# EAGLE design MTSensorV2.1 (EAGLE 8.0.2)
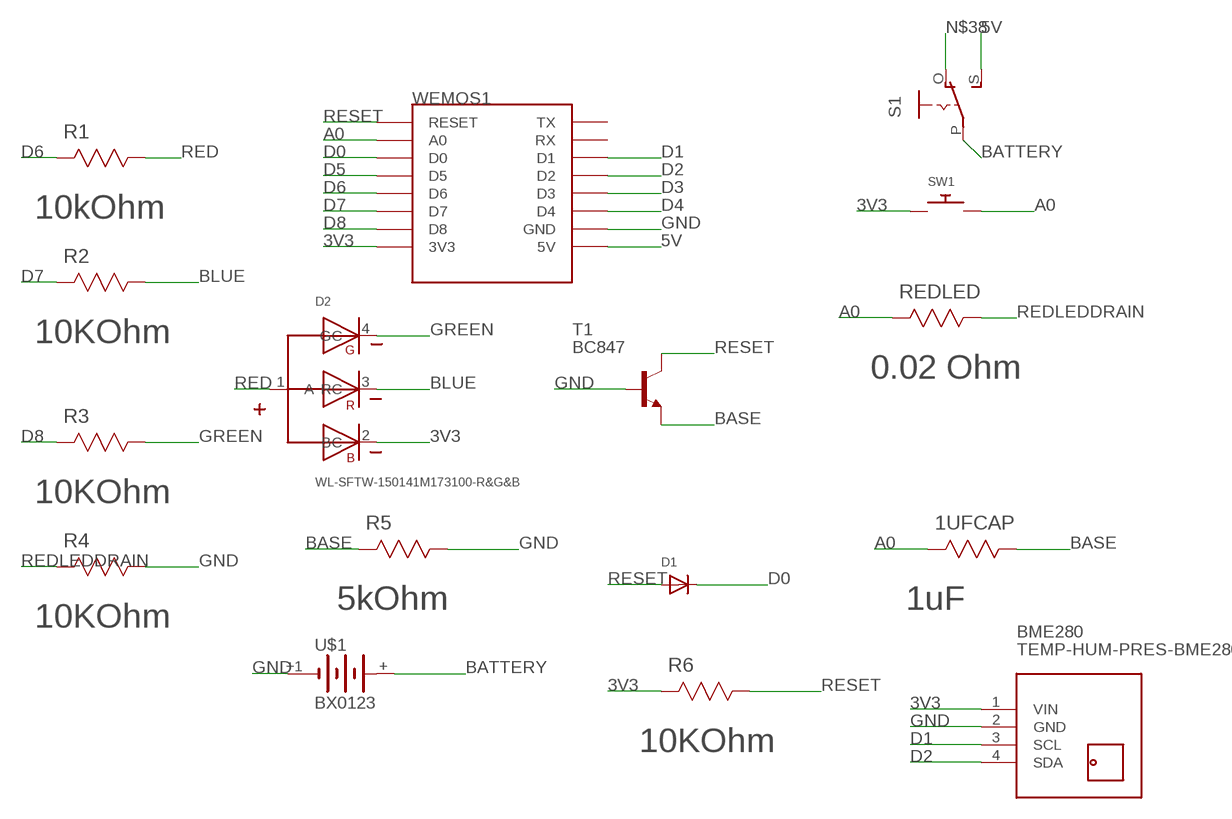
[diagram p0: schematic, sheet 1]

## Parts
1UFCAP  1uF  ERA-3AEB101V  [RESC1608X60N]
BME280  TEMP-HUM-PRES-BME280  [TEMP-HUM-PRES-BME280]
D1  DIODESOD-123  [SOD-123]
D2  WL-SFTW-150141M173100-R&G&B  [3528-COMMON-ANODE]
R1  10kOhm  ERJ-8BWFR010V  [RESC3216X71N]
R2  10KOhm  ERJ-8BWFR010V  [RESC3216X71N]
R3  10KOhm  ERJ-8BWFR010V  [RESC3216X71N]
R4  10KOhm  ERJ-8BWFR010V  [RESC3216X71N]
R5  5kOhm  ERJ-8BWFR011V  [RESC3216X71N]
R6  10KOhm  ERJ-8BWFR010V  [RESC3216X71N]
REDLED  0.02 Ohm  ERJ-8BWFR030V  [RESC3216X71N]
S1  EG1218S  [EG1218]
SW1  SWITCH_PUSHBUTTONEVQ-PE  [TACT_PANA-EVQ]
T1  BC847  [SOT23]
U$1  BX0123  [CR123A_HOLDER]
WEMOS1  WEMOS-D1-MINI  [WEMOS-D1-MINI]

## Nets
3V3: BME280.1(VIN) D2.2(BC) R6.2(R2) SW1.P$1 WEMOS1.3V3
5V: S1.S WEMOS1.5V
A0: 1UFCAP.2(R2) REDLED.2(R2) SW1.P$2 WEMOS1.A0
BASE: 1UFCAP.1(R1) R5.2(R2) T1.2(E)
BATTERY: S1.P U$1.+
BLUE: D2.3(RC) R2.1(R1)
D0: D1.C WEMOS1.D0
D1: BME280.3(SCL) WEMOS1.D1
D2: BME280.4(SDA) WEMOS1.D2
D3: WEMOS1.D3
D4: WEMOS1.D4
D5: WEMOS1.D5
D6: R1.2(R2) WEMOS1.D6
D7: R2.2(R2) WEMOS1.D7
D8: R3.2(R2) WEMOS1.D8
GND: BME280.2(GND) R4.1(R1) R5.1(R1) T1.1(B) U$1.+1(-) WEMOS1.GND
GREEN: D2.4(GC) R3.1(R1)
N$38: S1.O
RED: D2.1(A) R1.1(R1)
REDLEDDRAIN: R4.2(R2) REDLED.1(R1)
RESET: D1.A R6.1(R1) T1.3(C) WEMOS1.RESET
Unconnected: WEMOS1.RX WEMOS1.TX

## Library data of the parts
1UFCAP = Panasonic_By_element14_Batch_1:ERA-3AEB101V: RESISTOR, 0603; MPN: ERA-3AEB101V; OC_FARNELL: 1577593; OC_NEWARK: 08N2093; SUPPLIER: Panasonic; TOLERANCE: ±0.1%; VALUE: 100 Ohm; WATTAGE: 0.1 W
BME280 = diy-modules:TEMP-HUM-PRES-BME280: Digital Humidity-Temperature-Pressure Sensor based on BME280 device More information about BME280 device is available here: https://www.bosch-sensortec.com/bst/products/all_products/bme280 Click here to find device on ebay.com <http://www.ebay.com/sch/bme280+breakout>
D1 = adafruit:DIODE: Diode SMADIODE - SMA Surface Mount Package 20V 1A Schottky Diode Digikey: 641-1014-6-ND DO-1N4148 - Through Hole Small Current Diode SOD-123 20V 1 A (.5mV Vf) Schottky Diode - Digikey: MBRX120TPMSCT-ND SOD-323 10V 570mA (.38mV Vf, 3ns) Schottky Diode - Digikey: ZLLS410CT-ND SOD-523 30V 30mA Schottky Diode (RB751S-40TE61) - Digikey: RB751S-40TE61CT-ND SOT23-R/W - SOT23 Package (R = Solder Paste/Reflow Ovens, W = Hand-Soldering) BAT54Film 40V 300mA - Digikey: 497-7162-1-ND
D2 = Wurth_Elektronik_Optoelectronics_rev15b:WL-SFTW: SMD full-color TOP LED Characteristics Low energy consumption High reliability Low current requirement Fast switching No UV/IR radiation High brightness RGB individual control Compact package outline Black surface Applications Flash light Switch indicators Equipments indicators Accent and decorative lighting Electronic signage Video displays Backlight for LCDs, PDAs and TVs Oven, microwave Street lighting Ideal for lateral coupling in light guides <http://katalog.we-online.de/media/images/eipal/WL-SFTW_pf2.jpg> Details see: http://katalog.we-online.de/en/led/WL-SFTW?m Updated 2015-04-10 2015 (C) Wurth Elektronik
R1-R4 R6 = Panasonic_By_element14_Batch_1:ERJ-8BWFR010V: RESISTOR, 1206; MPN: ERJ-8BWFR010V; OC_FARNELL: 1577518; OC_NEWARK: 08N2405; SUPPLIER: Panasonic; TOLERANCE: ± 1 %; VALUE: 0.01 Ohm; WATTAGE: 0.5 W
R5 = Panasonic_By_element14_Batch_1:ERJ-8BWFR011V: RESISTOR, 1206; MPN: ERJ-8BWFR011V; OC_FARNELL: 1577519; OC_NEWARK: 08N2406; SUPPLIER: Panasonic; TOLERANCE: ± 1 %; VALUE: 0.01 Ohm; WATTAGE: 0.5 W
REDLED = Panasonic_By_element14_Batch_1:ERJ-8BWFR030V: RESISTOR, 1206; MPN: ERJ-8BWFR030V; OC_FARNELL: 1577531; OC_NEWARK: 08N2416; SUPPLIER: Panasonic; TOLERANCE: ± 1 %; WATTAGE: 0.5 W
S1 = adafruit:EG1218: SLIDING SWITCH 0.1" spacing through hole, vertical SPDT slide switch http://www.ladyada.net/library/pcb/eaglelibrary.html
SW1 = adafruit:SWITCH_PUSHBUTTON: Buttons SOFTTOUCHSMD_SJ - Soft touch temporary push button (Super Junk Akihabara) Compatible with SKPMANE010 [Mouser: 688-SKPMAN] C&K_KSS = Digikey: KSS221GLFS
T1 = transistor:BC847: NPN TRANSISTOR
U$1 = BX0123:BX0123: Battery Holder Bulgin BX0123; AVAILABILITY: Good; DESCRIPTION: Battery Holder; PC/Base Mount; Open Style; Dual Connections; Holds 1 CR123 Cell; MF: Bulgin; MP: BX0123; PACKAGE: None; PRICE: 1.54 USD
WEMOS1 = esp8266modules:WEMOS-D1-MINI: WeMos.cc D1 mini ESP8266 module

## Board
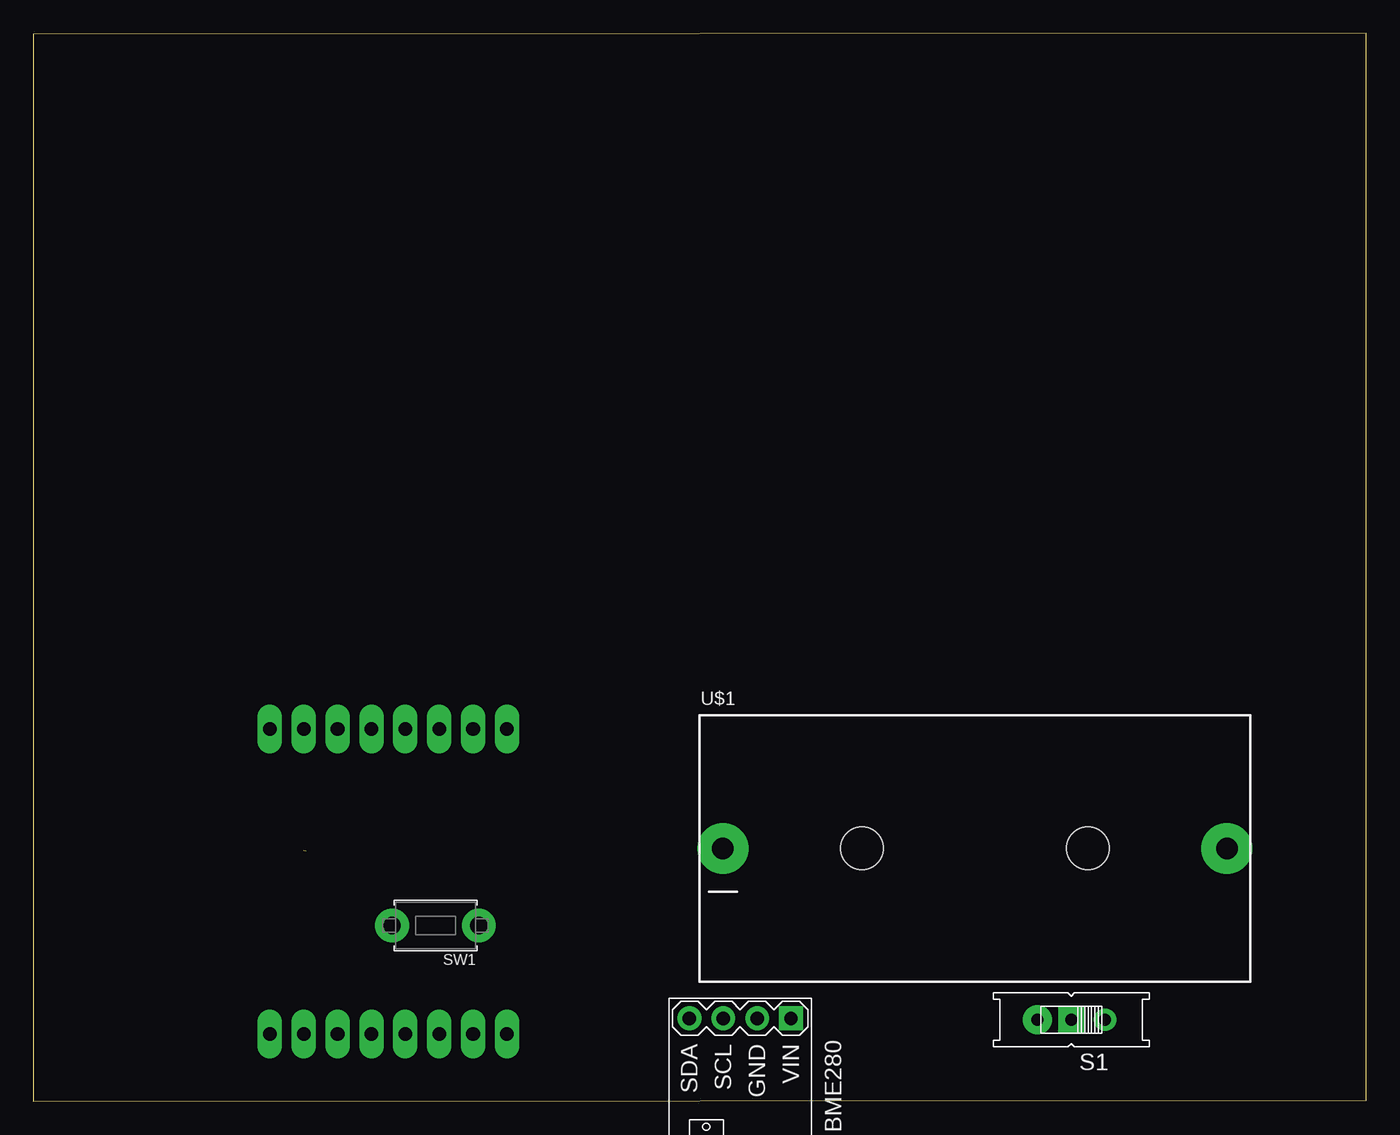
[diagram p1: board, top side]
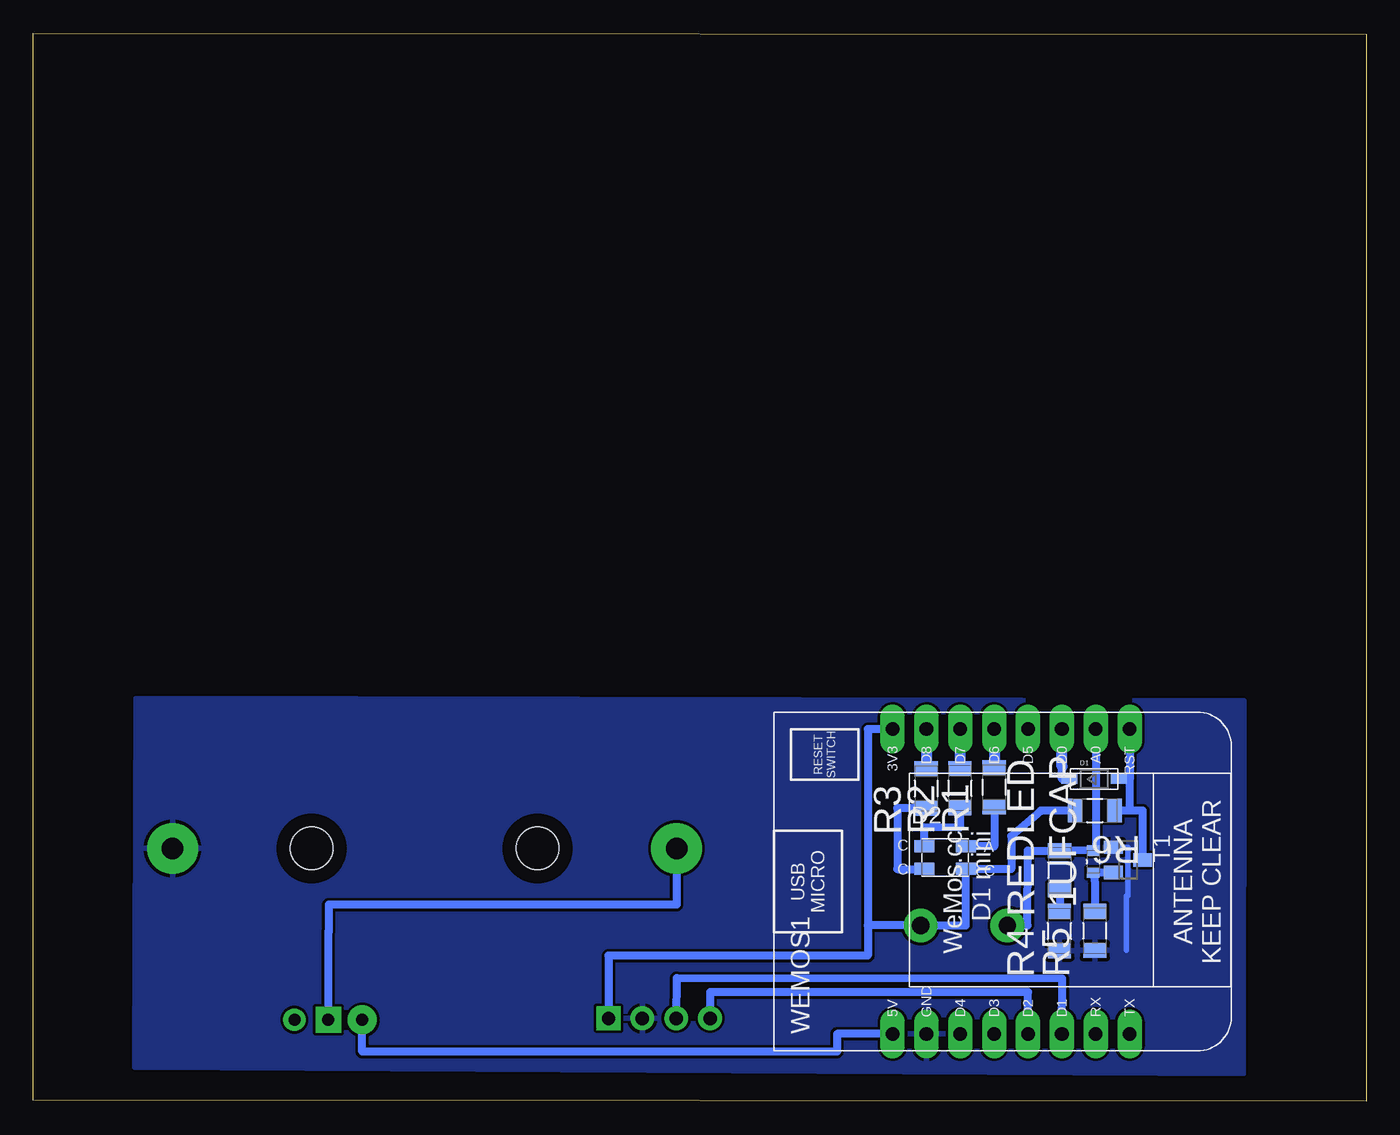
[diagram p2: board, bottom side, seen from below]

Size 99.96 x 80.08 mm. Coordinates in mm from the lower left corner, seen from the top.
Outline: 0,0 99.96,0.08 99.96,80.08 0,80 0,0
Copper layers (1*16): Top 0.035mm / dielectric 1.5mm / Bottom 0.035mm
Design rules "default": minimum track width 10mil, minimum drill 24mil, track to track 8mil, track to pad 8mil, pad to pad 8mil, via to via 8mil, smd to smd 8mil, copper to edge 40mil, drill to drill 8mil, minimum pad ring 10mil, minimum via ring 8mil, stop-mask expansion 4mil, vias tented up to drill 0mil, thermal gap 10mil

### Footprints (pad centres in the part's own frame; a part is rotated, then mirrored left to right if it is on the bottom)
RESC1608X60N = smd 0.762 x 0.94: 1 -0.838,0; 2 0.838,0
TEMP-HUM-PRES-BME280 = drill 1 pad 1.778 square: 1 -5.08,3.81 | drill 1 pad 1.778: 2 -5.08,1.27; 3 -5.08,-1.27; 4 -5.08,-3.81
SOD-123 = smd 1.2 x 0.7: A 1.85,0; C -1.85,0
3528-COMMON-ANODE = smd 1.5 x 0.9: 1 1.55,0.85; 2 1.55,-0.85; 3 -1.55,0.85; 4 -1.55,-0.85
RESC3216X71N = smd 1.118 x 1.753: 1 -1.473,0; 2 1.473,0
EG1218 = drill 0.9 pad 1.676: O -2.54,0 | drill 0.9 pad 1.93 square: P 0,0 | drill 0.9 pad 2.184: S 2.54,0
TACT_PANA-EVQ = drill 1.3 pad 2.54: P$1 -3.25,0; P$2 3.25,0
SOT23 = smd 1 x 1.4: 1 -0.95,-1.1; 2 0.95,-1.1; 3 0,1.1
CR123A_HOLDER = drill 1.6 pad 3.81: + -18.9,0; +1 18.9,0 | hole 3.2: -8.475,0; 8.475,0
WEMOS-D1-MINI = drill 1.016 pad 1.829 long: 3V3 -10.16,-10.16; 5V 12.7,-10.16; A0 -10.16,5.08; D0 -10.16,2.54; D1 12.7,2.54; D2 12.7,0; D3 12.7,-2.54; D4 12.7,-5.08; D5 -10.16,0; D6 -10.16,-2.54; D7 -10.16,-5.08; D8 -10.16,-7.62; GND 12.7,-7.62; RESET -10.16,7.62; RX 12.7,5.08; TX 12.7,7.62

### Placement (x,y rotation side)
1UFCAP  20.47,17.98 90 bottom
BME280  53.01,1.15 270 top
D1  20.4,24.17 0 bottom
D2  31.58,18.28 0 bottom
R1  27.9,23.55 90 bottom
R2  30.47,23.49 90 bottom
R3  32.99,23.47 90 bottom
R4  23.01,12.78 90 bottom
R5  20.35,12.79 90 bottom
R6  20.35,21.8 180 bottom
REDLED  22.99,17.33 90 bottom
S1  77.84,6.12 180 top
SW1  30.16,13.19 180 top
T1  17.86,18.11 270 bottom
U$1  70.62,18.97 0 top
WEMOS1  25.36,17.76 270 bottom

### Tracks (layer width: path | path; a pad name or v marks a point on that pad's centre or on a via)
3V3
  Bottom 0.61: WEMOS1.3V3 37.38,27.92 37.38,13.19 | 37.38,13.19 SW1.P$1 30.04,13.19 D2.2 26.61,17.43 26.61,19.89 24.4,21.77 24.4,21.8 R6.2 | BME280.1 56.82,10.93 37.38,10.93 37.38,13.19
5V
  Bottom 0.61: WEMOS1.5V 39.68,5.06 39.68,3.73 75.3,3.73 S1.S
  Bottom 0.813: 35.52,5.04 WEMOS1.5V
A0  (1 unrouted)
  Bottom 0.61: WEMOS1.A0 20.27,18.82 REDLED.2 25.39,18.8 25.4,13.19 SW1.P$2
BASE
  Bottom 0.61: R5.2 20.34,16.36 1UFCAP.1 20.33,17.16 T1.2
BATTERY
  Bottom 0.61: S1.P 77.84,12.76 77.8,12.76 77.8,14.75 51.72,14.75 U$1.+
  Bottom 0.813: 51.65,18.97 U$1.+
BLUE
  Bottom 0.61: R2.1 30.48,20.53 33.16,20.54 33.16,19.13 D2.3
D0
  Bottom 0.61: D1.C 22.82,24.17 22.82,25.11
  Bottom 0.813: 22.86,28.02 WEMOS1.D0 22.82,25.11
D1
  Bottom 0.406: 22.7,5.16 WEMOS1.D1
  Bottom 0.61: WEMOS1.D1 22.79,9.21 51.72,9.24 BME280.3
D2
  Bottom 0.406: 25.38,5.16 WEMOS1.D2
  Bottom 0.61: WEMOS1.D2 25.36,8.19 49.2,8.19 BME280.4
D6
  Bottom 0.813: WEMOS1.D6 R1.2
D7
  Bottom 0.813: WEMOS1.D7 R2.2
D8
  Bottom 0.813: WEMOS1.D8 R3.2
GND
  Bottom 0.406: T1.1 17.87,19.06 17.87,15.44 17.98,15.44 17.98,11.33
  pour Bottom: 9.17,30.03 92.24,30.23 92.35,2.57 9.2,2.07
GREEN
  Bottom 0.61: 33.14,17.4 D2.4 33.14,17.42 35.16,17.42 35.16,21.99 R3.1
RED
  Bottom 0.61: R1.1 27.9,19.13 D2.1
REDLEDDRAIN
  Bottom 0.61: REDLED.1 22.99,14.63 R4.2
RESET
  Bottom 0.61: WEMOS1.RESET 17.74,24.17 | 17.74,24.17 D1.A | 17.74,21.8 17.74,24.17 | 17.74,21.8 R6.1 | 17.74,21.8 16.75,21.8 16.75,18.43 T1.3